# Altium schematic sheet TopLevel.SchDoc
size B; SheetNumber: 1; SheetTotal: 14
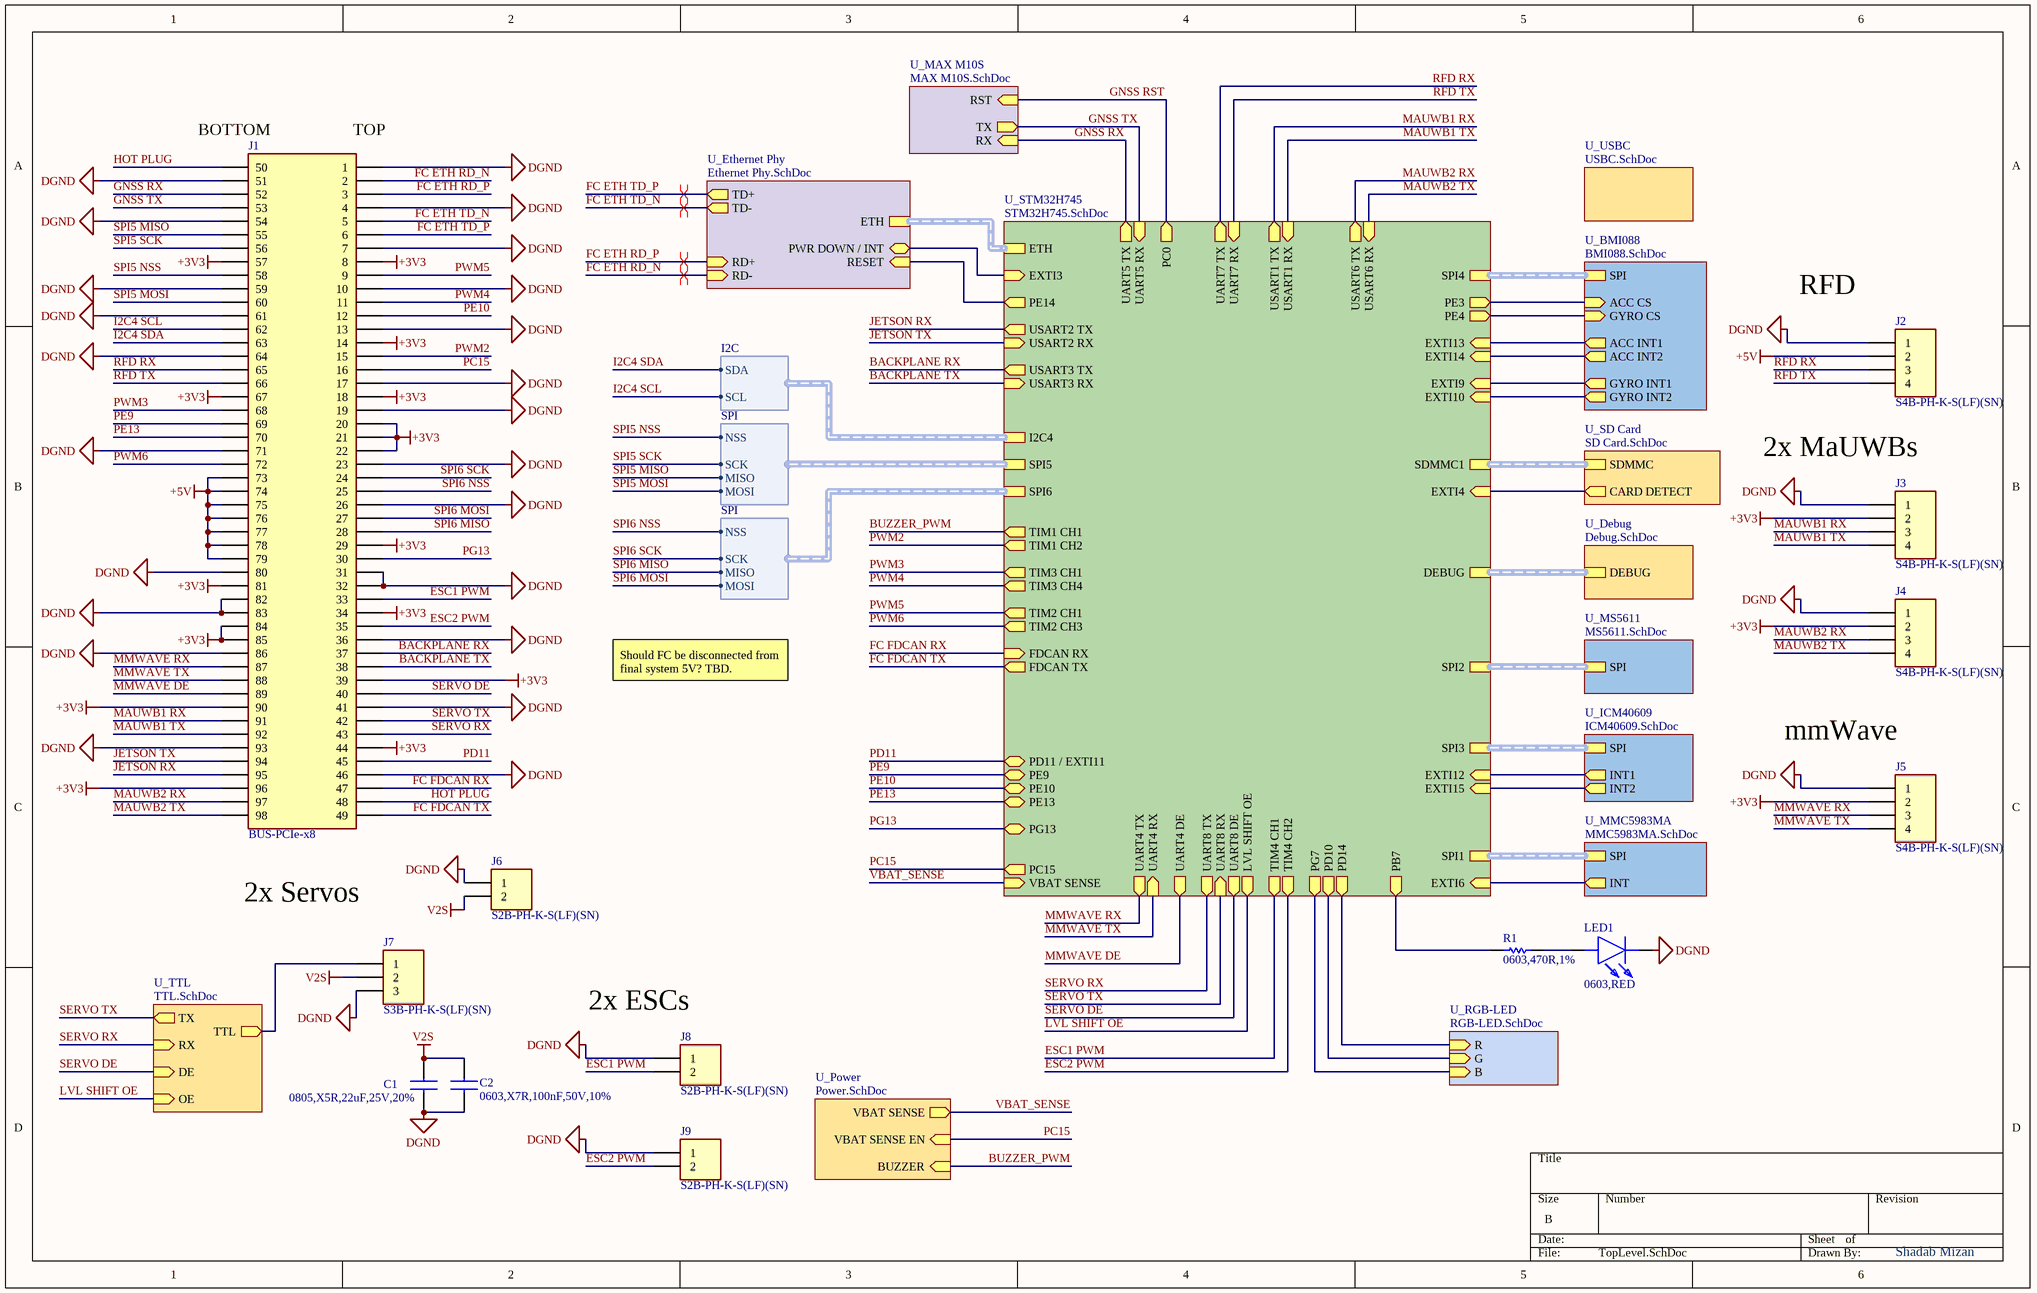
[diagram p0: TopLevel.SchDoc]

## Parts
C1  0805,X5R,22uF,25V,20%  [CAPC2012X145N]
C2  0603,X7R,100nF,50V,10%  [CAPC1608X90N]
J1  BUS-PCIe-x8  [BUS_PCIexpress_x8]  (no BOM)
J2  S4B-PH-K-S(LF)(SN)  [S4B-PH-K-S-_LF_SN]
J3  S4B-PH-K-S(LF)(SN)  [S4B-PH-K-S-_LF_SN]
J4  S4B-PH-K-S(LF)(SN)  [S4B-PH-K-S-_LF_SN]
J5  S4B-PH-K-S(LF)(SN)  [S4B-PH-K-S-_LF_SN]
J6  S2B-PH-K-S(LF)(SN)  [S2B-PH-K-S_LF_SN]
J7  S3B-PH-K-S(LF)(SN)  [S3B-PH-K-S-_LF_SN]
J8  S2B-PH-K-S(LF)(SN)  [S2B-PH-K-S_LF_SN]
J9  S2B-PH-K-S(LF)(SN)  [S2B-PH-K-S_LF_SN]
LED1  0603,RED  [LEDC1608X36N]
R1  0603,470R,1%  [RESC1608X90N]

## Sub-sheets
U_BMI088 = BMI088.SchDoc: ACC CS (in), GYRO CS (in), SPI (harness SPI), ACC INT1 (out), ACC INT2 (out), GYRO INT1 (out), GYRO INT2 (out)
U_Debug = Debug.SchDoc: DEBUG (harness DEBUG)
U_Ethernet Phy = Ethernet Phy.SchDoc: ETH (harness ETH), TD+ (out), TD- (out), RD+ (in), RD- (in), PWR DOWN / INT (bidir), RESET (in)
U_ICM40609 = ICM40609.SchDoc: INT1 (out), INT2 (out), SPI (harness SPI)
U_MAX M10S = MAX M10S.SchDoc: RX (in), TX (out), RST (in)
U_MMC5983MA = MMC5983MA.SchDoc: INT (out), SPI (harness SPI)
U_MS5611 = MS5611.SchDoc: SPI (harness SPI)
U_Power = Power.SchDoc: VBAT SENSE (out), BUZZER (in), VBAT SENSE EN (in)
U_RGB-LED = RGB-LED.SchDoc: R (in), G (in), B (in)
U_SD Card = SD Card.SchDoc: SDMMC (harness SDMMC), CARD DETECT (out)
U_STM32H745 = STM32H745.SchDoc: SPI1 (harness SPI), SPI2 (harness SPI), SPI3 (harness SPI), SPI4 (harness SPI), SPI5 (harness SPI), SPI6 (harness SPI), I2C4 (harness I2C), SDMMC1 (harness SDMMC), ETH (harness ETH), PE3 (out), PE4 (out), EXTI13 (in), EXTI14 (in), EXTI9 (in), EXTI10 (in), EXTI4 (in), EXTI12 (in), EXTI15 (in), FDCAN TX (out), FDCAN RX (in), UART4 TX (out), UART4 RX (in), UART4 DE (out), UART8 TX (out), UART8 RX (in), USART6 TX (out), USART6 RX (in), USART2 TX (out), USART2 RX (in), USART3 TX (out), USART3 RX (in), UART7 TX (out), UART7 RX (in), UART5 RX (in), UART5 TX (out), EXTI6 (in), PC0 (out), TIM1 CH1 (out), TIM1 CH2 (out), TIM3 CH1 (out), TIM3 CH4 (out), DEBUG (harness SPI), TIM4 CH1 (out), TIM4 CH2 (out), TIM2 CH1 (out), TIM2 CH3 (out), EXTI3 (in), PG13 (bidir), PE10 (bidir), PE13 (bidir), UART8 DE (out), USART1 TX (out), USART1 RX (in), LVL SHIFT OE (out), PE14 (out), PD11 / EXTI11 (bidir), VBAT SENSE (in), PE9 (bidir), PC15 (out), PG7 (out), PD10 (out), PD14 (out), PB7 (out)
U_TTL = TTL.SchDoc: TX (out), OE (in), DE (in), RX (in), TTL (out)
U_USBC = USBC.SchDoc: no entries

## Harnesses
SPI: NSS, SCK, MISO, MOSI
I2C: SDA, SCL

## Nets
+3V3: J1.8 J1.14 J1.18 J1.20 J1.21 J1.22 J1.29 J1.34 J1.39 J1.44 J1.57 J1.67 J1.81 J1.84 J1.85 J1.90 J1.96 J3.2 J4.2 J5.2
+5V: J1.73 J1.74 J1.75 J1.76 J1.77 J1.78 J1.79 J2.2
DGND: C1.1 C2.1 J1.1 J1.4 J1.7 J1.10 J1.13 J1.17 J1.19 J1.23 J1.26 J1.31 J1.32 J1.36 J1.41 J1.46 J1.51 J1.54 J1.59 J1.61 J1.64 J1.71 J1.80 J1.82 J1.83 J1.86 J1.93 J2.1 J3.1 J4.1 J5.1 J6.1 J7.3 J8.1 J9.1 LED1.1(K)
V2S: C1.2 C2.2 J6.2 J7.2
BACKPLANE RX: J1.37 ; sheet U_STM32H745/USART3 TX
BACKPLANE TX: J1.38 ; sheet U_STM32H745/USART3 RX
BUZZER_PWM: sheet U_STM32H745/TIM1 CH1, sheet U_Power/BUZZER
ESC1 PWM: J1.33 J8.2 ; sheet U_STM32H745/TIM4 CH1
ESC2 PWM: J1.35 J9.2 ; sheet U_STM32H745/TIM4 CH2
FC ETH RD_N: J1.2 ; sheet U_Ethernet Phy/RD-
FC ETH RD_P: J1.3 ; sheet U_Ethernet Phy/RD+
FC ETH TD_N: J1.5 ; sheet U_Ethernet Phy/TD-
FC ETH TD_P: J1.6 ; sheet U_Ethernet Phy/TD+
FC FDCAN RX: J1.47 ; sheet U_STM32H745/FDCAN RX
FC FDCAN TX: J1.49 ; sheet U_STM32H745/FDCAN TX
GNSS RST: sheet U_STM32H745/PC0, sheet U_MAX M10S/RST
GNSS RX: J1.52 ; sheet U_STM32H745/UART5 TX, sheet U_MAX M10S/RX
GNSS TX: J1.53 ; sheet U_STM32H745/UART5 RX, sheet U_MAX M10S/TX
HOT PLUG: J1.48 J1.50
I2C4 SCL: J1.62 ; sheet U_STM32H745/I2C4.SCL
I2C4 SDA: J1.63 ; sheet U_STM32H745/I2C4.SDA
JETSON RX: J1.95 ; sheet U_STM32H745/USART2 TX
JETSON TX: J1.94 ; sheet U_STM32H745/USART2 RX
LVL SHIFT OE: sheet U_STM32H745/LVL SHIFT OE, sheet U_TTL/OE
MAUWB1 RX: J1.91 J3.3 ; sheet U_STM32H745/USART1 TX
MAUWB1 TX: J1.92 J3.4 ; sheet U_STM32H745/USART1 RX
MAUWB2 RX: J1.97 J4.3 ; sheet U_STM32H745/USART6 TX
MAUWB2 TX: J1.98 J4.4 ; sheet U_STM32H745/USART6 RX
MMWAVE DE: J1.89 ; sheet U_STM32H745/UART4 DE
MMWAVE RX: J1.87 J5.3 ; sheet U_STM32H745/UART4 TX
MMWAVE TX: J1.88 J5.4 ; sheet U_STM32H745/UART4 RX
PC15: J1.16 ; sheet U_STM32H745/PC15, sheet U_Power/VBAT SENSE EN
PD11: J1.45 ; sheet U_STM32H745/PD11 / EXTI11
PE9: J1.69 ; sheet U_STM32H745/PE9
PE10: J1.12 ; sheet U_STM32H745/PE10
PE13: J1.70 ; sheet U_STM32H745/PE13
PG13: J1.30 ; sheet U_STM32H745/PG13
PWM2: J1.15 ; sheet U_STM32H745/TIM1 CH2
PWM3: J1.68 ; sheet U_STM32H745/TIM3 CH1
PWM4: J1.11 ; sheet U_STM32H745/TIM3 CH4
PWM5: J1.9 ; sheet U_STM32H745/TIM2 CH1
PWM6: J1.72 ; sheet U_STM32H745/TIM2 CH3
RFD RX: J1.65 J2.3 ; sheet U_STM32H745/UART7 TX
RFD TX: J1.66 J2.4 ; sheet U_STM32H745/UART7 RX
SERVO DE: J1.40 ; sheet U_STM32H745/UART8 DE, sheet U_TTL/DE
SERVO RX: J1.43 ; sheet U_STM32H745/UART8 TX, sheet U_TTL/RX
SERVO TX: J1.42 ; sheet U_STM32H745/UART8 RX, sheet U_TTL/TX
SPI5 MISO: J1.55 ; sheet U_STM32H745/SPI5.MISO
SPI5 MOSI: J1.60 ; sheet U_STM32H745/SPI5.MOSI
SPI5 NSS: J1.58 ; sheet U_STM32H745/SPI5.NSS
SPI5 SCK: J1.56 ; sheet U_STM32H745/SPI5.SCK
SPI6 MISO: J1.28 ; sheet U_STM32H745/SPI6.MISO
SPI6 MOSI: J1.27 ; sheet U_STM32H745/SPI6.MOSI
SPI6 NSS: J1.25 ; sheet U_STM32H745/SPI6.NSS
SPI6 SCK: J1.24 ; sheet U_STM32H745/SPI6.SCK
VBAT_SENSE: sheet U_STM32H745/VBAT SENSE, sheet U_Power/VBAT SENSE
NetJ7_1: J7.1 ; sheet U_TTL/TTL
NetLED1_2: LED1.2(A) R1.2
NetR1_1: R1.1 ; sheet U_STM32H745/PB7
(unnamed): sheet U_STM32H745/PE3, sheet U_BMI088/ACC CS
(unnamed): sheet U_STM32H745/PE4, sheet U_BMI088/GYRO CS
(unnamed): sheet U_STM32H745/EXTI13, sheet U_BMI088/ACC INT1
(unnamed): sheet U_STM32H745/EXTI14, sheet U_BMI088/ACC INT2
(unnamed): sheet U_STM32H745/EXTI9, sheet U_BMI088/GYRO INT1
(unnamed): sheet U_STM32H745/EXTI10, sheet U_BMI088/GYRO INT2
(unnamed): sheet U_STM32H745/EXTI4, sheet U_SD Card/CARD DETECT
(unnamed): sheet U_STM32H745/EXTI12, sheet U_ICM40609/INT1
(unnamed): sheet U_STM32H745/EXTI15, sheet U_ICM40609/INT2
(unnamed): sheet U_STM32H745/EXTI6, sheet U_MMC5983MA/INT
(unnamed): sheet U_STM32H745/EXTI3, sheet U_Ethernet Phy/PWR DOWN / INT
(unnamed): sheet U_STM32H745/PE14, sheet U_Ethernet Phy/RESET
(unnamed): sheet U_STM32H745/PG7, sheet U_RGB-LED/B
(unnamed): sheet U_STM32H745/PD10, sheet U_RGB-LED/G
(unnamed): sheet U_STM32H745/PD14, sheet U_RGB-LED/R

## Buses and harness runs
harness sheet U_BMI088/SPI = sheet U_STM32H745/SPI4
harness sheet U_Debug/DEBUG = sheet U_STM32H745/DEBUG
harness sheet U_Ethernet Phy/ETH = sheet U_STM32H745/ETH
harness sheet U_ICM40609/SPI = sheet U_STM32H745/SPI3
harness sheet U_MMC5983MA/SPI = sheet U_STM32H745/SPI1
harness sheet U_MS5611/SPI = sheet U_STM32H745/SPI2
harness sheet U_SD Card/SDMMC = sheet U_STM32H745/SDMMC1

## Layout directives
differential pair: FC ETH RD_N, FC ETH RD_P, FC ETH TD_N, FC ETH TD_P

## Notes on the sheet
- (near J1) BOTTOM
- (near J1) TOP
- RFD
- 2x MaUWBs
- Should FC be disconnected from final system 5V? TBD.
- mmWave
- 2x Servos
- (near J8) 2x ESCs
- Shadab Mizan

## Library data of the parts
C1 = CL21A226MAQNNNE: 22uF ±20% 25V Ceramic Capacitor X5R 0805; LCSC Part #: C45783; Manu Part #: CL21A226MAQNNNE
C2 = CC0603KRX7R9BB104: 50V 100nF X7R ±10% 0603 Multilayer Ceramic Capacitors MLCC - SMD/SMT ROHS; LCSC Part #: C14663; Manu Part #: CC0603KRX7R9BB104
J1 = BUS-PCIe-x8: PCIe x8
J2-J5 = S4B-PH-K-S(LF)(SN): Connector Header 4 position 2mm Pitch 2A Right Angle -25℃~+85℃; LCSC Part #: C157926; Manu Part #: S4B-PH-K-S(LF)(SN)
J6 J8 J9 = S2B-PH-K-S(LF)(SN): Connector Header 2 position 2mm Pitch 2A Right Angle -25℃~+85℃; LCSC Part #: C173752; Manu Part #: S2B-PH-K-S(LF)(SN)
J7 = S3B-PH-K-S(LF)(SN): Connector Header 3 position 2mm Pitch 2A Right Angle -25℃~+85℃; LCSC Part #: C157929; Manu Part #: S3B-PH-K-S(LF)(SN)
LED1 = KT-0603R: -40℃~+85℃ 1.8V~2.4V 120° 20mA 300mcd 40mW 615nm~630nm 645nm Discrete Diode Red Water Clear 0603 LED Indication - Discrete ROHS; Manu Part #: KT-0603R; LCSC Part #: C2286
R1 = 0603WAF4700T5E: -55℃~+155℃ 100mW 470Ω 75V Thick Film Resistor ±1% ±100ppm/℃ 0603 Chip Resistor - Surface Mount ROHS; LCSC Part #: C23179; Manu Part #: 0603WAF4700T5E